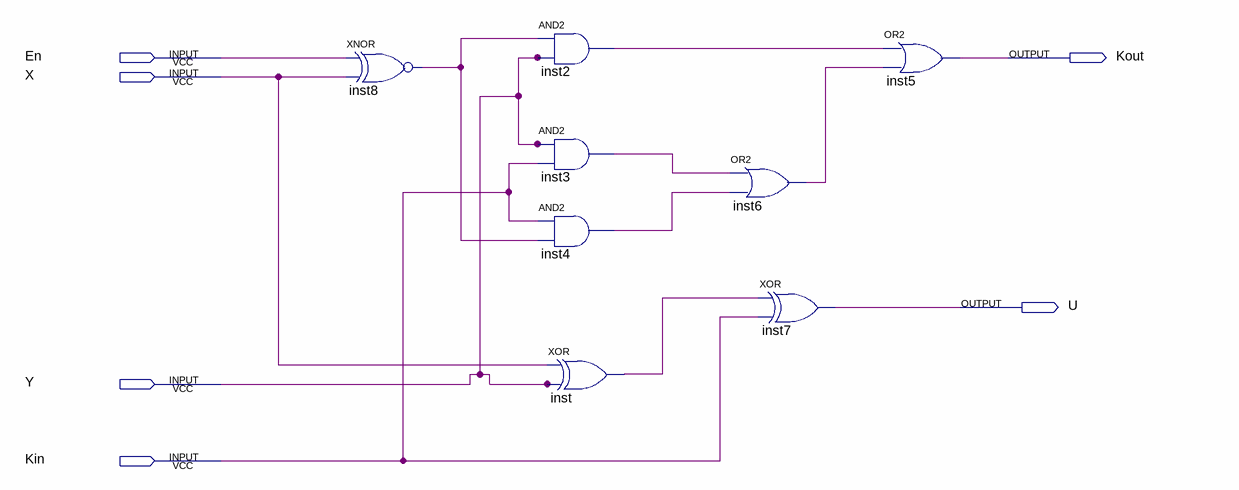
[diagram p0: schematic sheet]
// Quartus schematic EECS301Lab6.bdf as structural Verilog: 8 symbols, 6 pins
module EECS301Lab6 (
  input  En,
  input  X,
  input  Y,
  input  Kin,
  output Kout,
  output U
);

  wire inst2_out, inst3_out, inst4_out, inst6_out, inst8_out, inst_out;

  xnor inst8 (inst8_out, En, X);
  and inst2 (inst2_out, inst8_out, Y);
  and inst3 (inst3_out, Y, Kin);
  and inst4 (inst4_out, Kin, inst8_out);
  xor inst (inst_out, X, Y);
  or inst6 (inst6_out, inst3_out, inst4_out);
  xor inst7 (U, inst_out, Kin);
  or inst5 (Kout, inst2_out, inst6_out);
endmodule
